# EAGLE design gbikePCB (EAGLE 6.3)
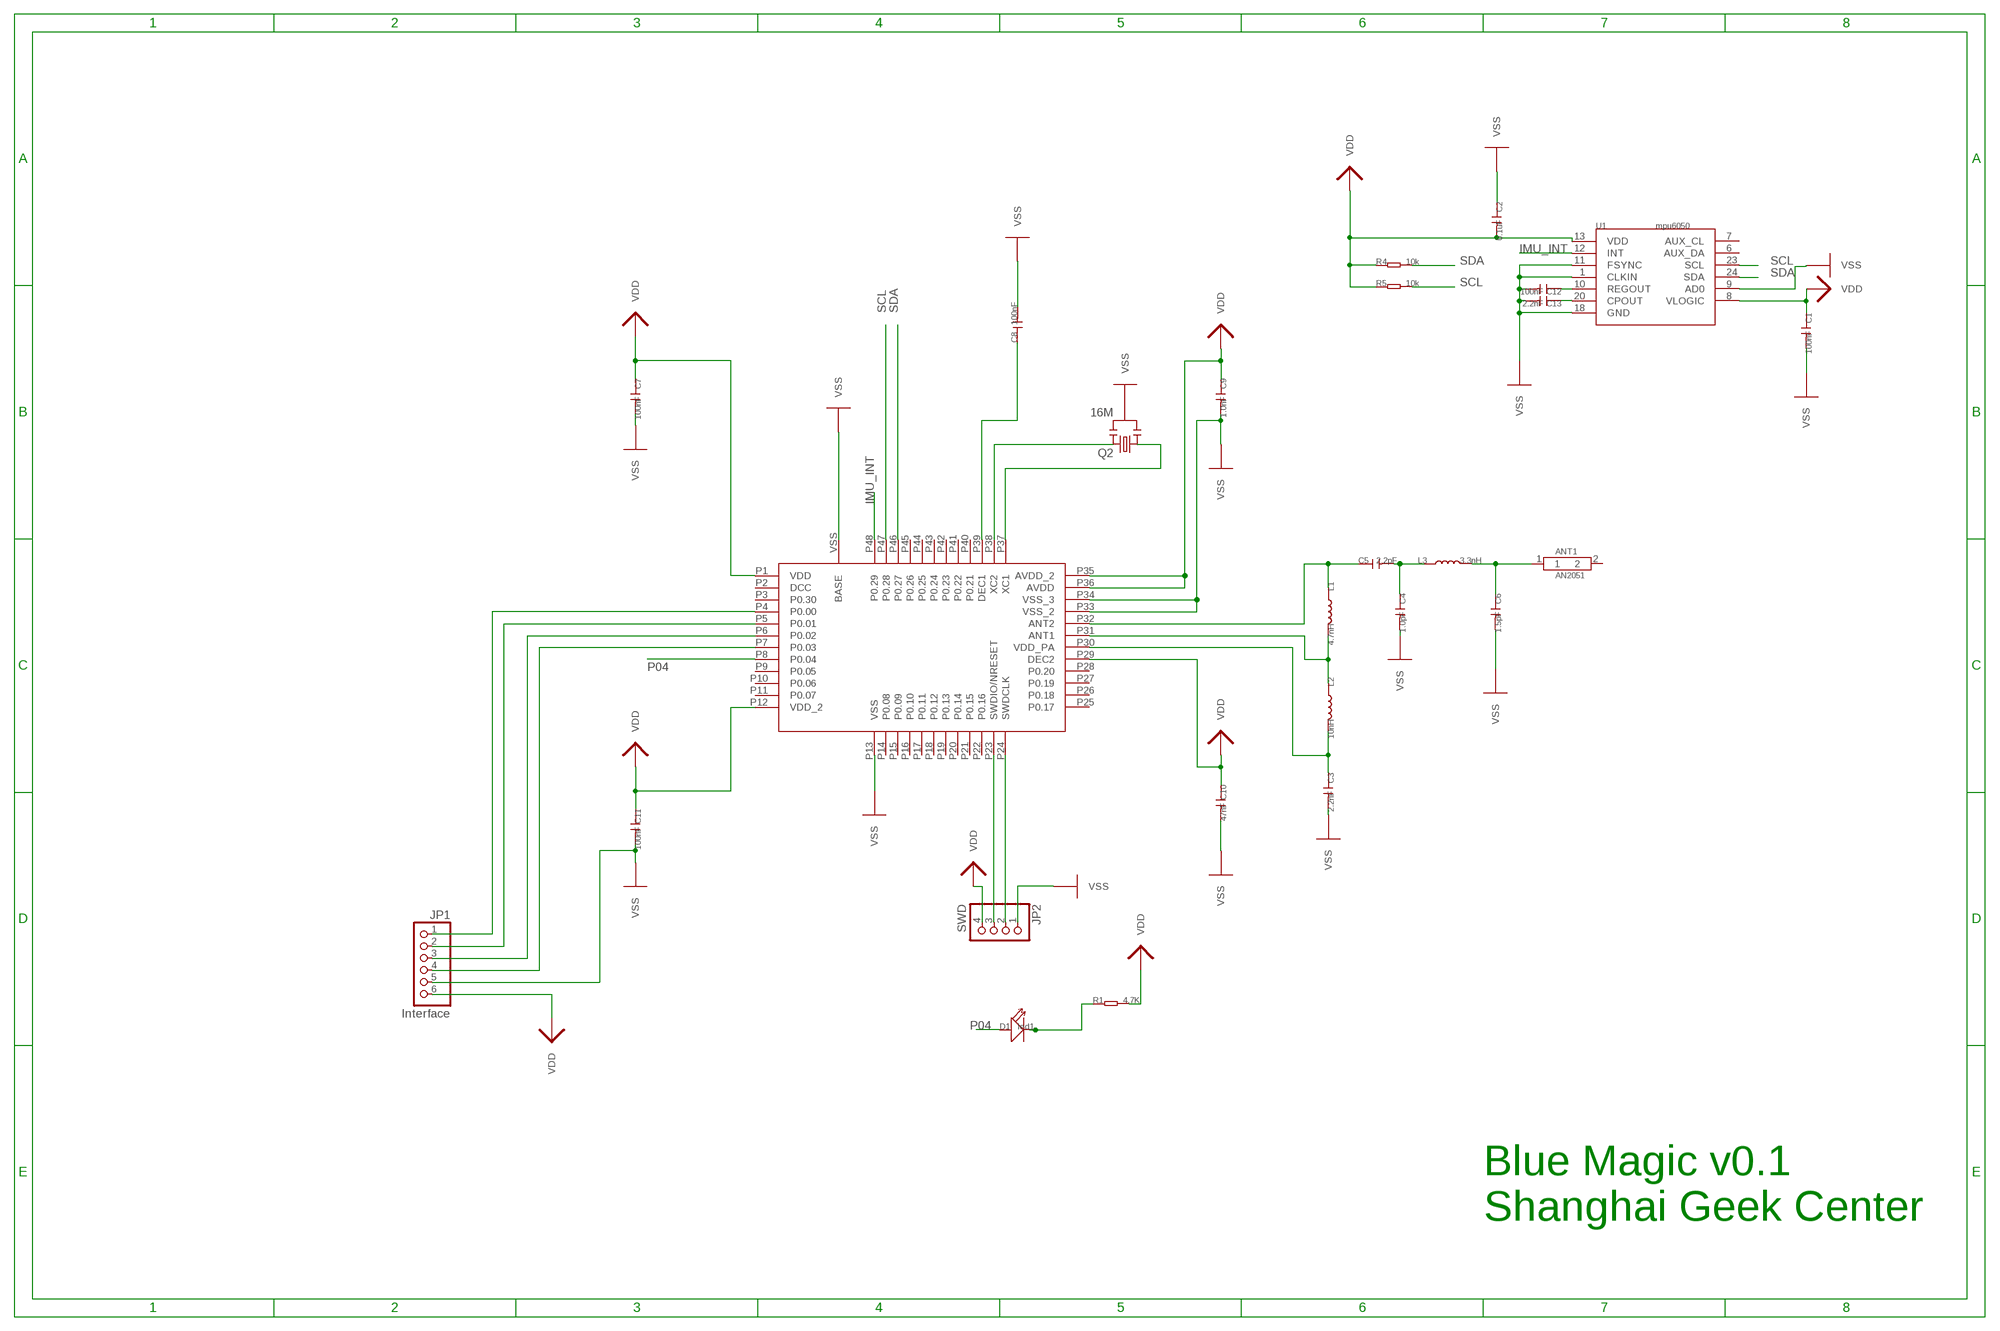
[diagram p0: schematic, sheet 1]

## Parts
ANT1  AN2051  CONNECTOR_ANTENNA-2.4GHZ-0.5DBIAN2051  [CONNECTOR_2P-SMD-L5.05*W.02*H1.07MM]
C1  100nF  DISCRETE_C-0603  [DISCRETE_C0603]
C2  0.1uF  DISCRETE_C-0603  [DISCRETE_C0603]
C3  2.2nF  DISCRETE_C-0603  [DISCRETE_C0603]
C4  1.0pF  DISCRETE_C-0603  [DISCRETE_C0603]
C5  2.2pF  DISCRETE_C-0603  [DISCRETE_C0603]
C6  1.5pF  DISCRETE_C-0603  [DISCRETE_C0603]
C7  100nF  DISCRETE_C-0603  [DISCRETE_C0603]
C8  100nF  DISCRETE_C-0603  [DISCRETE_C0603]
C9  1.0nF  DISCRETE_C-0603  [DISCRETE_C0603]
C10  47nF  DISCRETE_C-0603  [DISCRETE_C0603]
C11  100nF  DISCRETE_C-0603  [DISCRETE_C0603]
C12  100nF  DISCRETE_C-0603  [DISCRETE_C0603]
C13  2.2nF  DISCRETE_C-0603  [DISCRETE_C0603]
D1  led1  DISCRETE_LED0603  [DISCRETE_LED-0603]
JP1  Interface  PINHD-1X6  [1X06]
JP2  SWD  PINHD-1X4  [1X04]
L1  4.7nH  DISCRETE_L0603  [DISCRETE_L0603]
L2  10nH  DISCRETE_L0603  [DISCRETE_L0603]
L3  3.3nH  DISCRETE_L0603  [DISCRETE_L0603]
NRF51822  nRF51822  NRF51822_NRF51822_NRF51822  [NRF51822_NRF51822_QFN48]
Q2  16M  DIYDRONES3_RESONATORSMD  [DIYDRONES3_RESONATOR-SMD]
R1  4.7K  DISCRETE_R-0603  [DISCRETE_R0603]
R4  10k  DISCRETE_R-0603  [DISCRETE_R0603]
R5  10k  DISCRETE_R-0603  [DISCRETE_R0603]
U1  mpu6050  TINY_BLE_V1.0_TEMPLATE_MPU-6050???¡¥  [TINY_BLE_V1.0_TEMPLATE_QFN24]

## Nets
IMU_INT: NRF51822.P48(P0.29) U1.12(INT)
N$2: JP1.1 NRF51822.P4(P0.00)
N$3: C3.1 L2.2 NRF51822.P30(VDD_PA)
N$4: NRF51822.P38(XC2) Q2.3
N$5: C8.1 NRF51822.P39(DEC1)
N$6: C5.1 L1.1 NRF51822.P32(ANT2)
N$7: C4.1 C5.2 L3.1
N$8: ANT1.1 C6.1 L3.2
N$9: NRF51822.P37(XC1) Q2.1
N$10: JP1.2 NRF51822.P5(P0.01)
N$11: JP1.3 NRF51822.P6(P0.02)
N$12: L1.2 L2.1 NRF51822.P31(ANT1)
N$13: JP1.4 NRF51822.P7(P0.03)
N$17: D1.- R1.1
N$18: C12.1 U1.10(REGOUT)
N$19: C13.1 U1.20(CPOUT)
N$28: JP2.3 NRF51822.P23(SWDIO/NRESET)
N$29: JP2.2 NRF51822.P24(SWDCLK)
P04: D1.+ NRF51822.P8(P0.04)
SCL: NRF51822.P47(P0.28) R5.2 U1.23(SCL)
SDA: NRF51822.P46(P0.27) R4.2 U1.24(SDA)
VDD: C1.1 C2.2 C7.1 C9.1 C10.1 C11.1 JP1.6 JP2.4 NRF51822.P1(VDD) NRF51822.P12(VDD_2) NRF51822.P29(DEC2) NRF51822.P35(AVDD_2) NRF51822.P36(AVDD) R1.2 R4.1 R5.1 U1.8(VLOGIC) U1.13(VDD)
VSS: C1.2 C2.1 C3.2 C4.2 C6.2 C7.2 C8.2 C9.2 C10.2 C11.2 C12.2 C13.2 JP1.5 JP2.1 NRF51822.P13(VSS) NRF51822.P33(VSS_2) NRF51822.P34(VSS_3) NRF51822.VSS(BASE) Q2.2 U1.1(CLKIN) U1.9(AD0) U1.11(FSYNC) U1.18(GND)
Unconnected: ANT1.2 NRF51822.P2(DCC) NRF51822.P3(P0.30) NRF51822.P9(P0.05) NRF51822.P10(P0.06) NRF51822.P11(P0.07) NRF51822.P14(P0.08) NRF51822.P15(P0.09) NRF51822.P16(P0.10) NRF51822.P17(P0.11) NRF51822.P18(P0.12) NRF51822.P19(P0.13) NRF51822.P20(P0.14) NRF51822.P21(P0.15) NRF51822.P22(P0.16) NRF51822.P25(P0.17) NRF51822.P26(P0.18) NRF51822.P27(P0.19) NRF51822.P28(P0.20) NRF51822.P40(P0.21) NRF51822.P41(P0.22) NRF51822.P42(P0.23) NRF51822.P43(P0.24) NRF51822.P44(P0.25) NRF51822.P45(P0.26) U1.6(AUX_DA) U1.7(AUX_CL)

## Notes on the sheet
- Blue Magic v0.1
  Shanghai Geek Center

## Library data of the parts
ANT1 = Tiny_BLE_V1.0:CONNECTOR_ANTENNA-2.4GHZ-0.5DBI: AN2051 Multilayer Chip Antenna for 2.4GHz Wireless Communication
C1-C13 = Tiny_BLE_V1.0:DISCRETE_C*: Ceramic Capacitors
D1 = Tiny_BLE_V1.0:DISCRETE_LED*
JP1 = pinhead:PINHD-1X6: PIN HEADER
JP2 = pinhead:PINHD-1X4: PIN HEADER
L1-L3 = Tiny_BLE_V1.0:DISCRETE_L*
NRF51822 = nRF51822ModifiedFortValue:NRF51822_NRF51822_NRF51822: NRF51822 Nordic Semiconductor 48 pin QFN Metric measurements....
Q2 = APM_v2:DIYDRONES3_RESONATOR: Resonator Small SMD resonator. This is the itty bitty 10/20MHz resonators with built in caps. CSTCE10M0G55 and CSTCE20M0V53. Footprint has been reviewed closely but hasn't been tested yet.
R1 R4 R5 = Tiny_BLE_V1.0:DISCRETE_R*
U1 = nRF51822:TINY_BLE_V1.0_TEMPLATE_MPU-6050

## Net classes
0 default: width 0.102 mm, drill 0.203 mm, clearance 0.102 mm

## Board
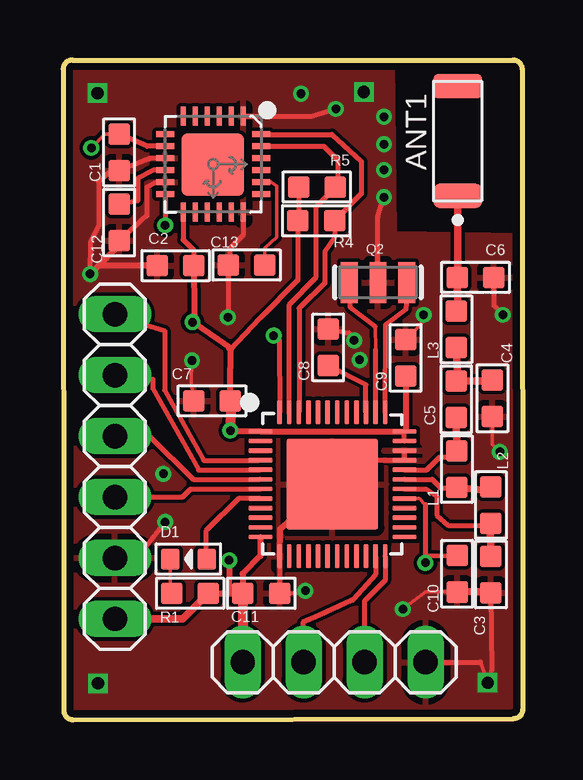
[diagram p1: board, top side]
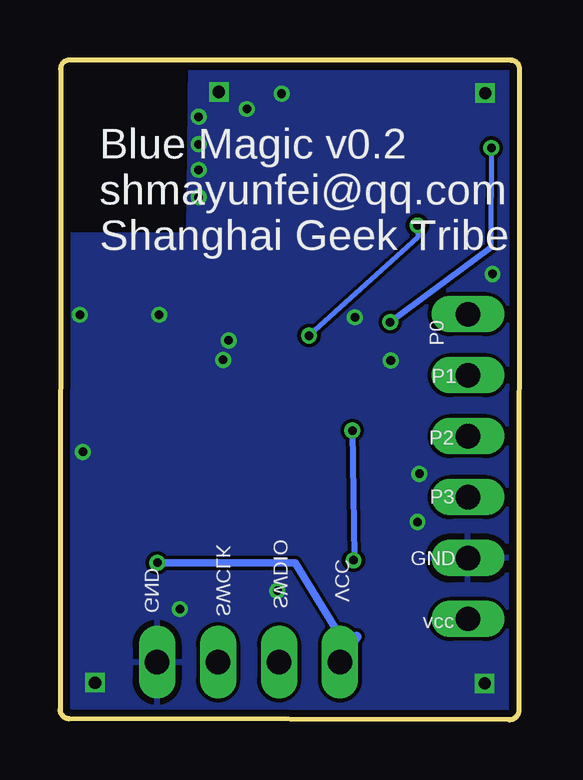
[diagram p2: board, bottom side, seen from below]

Size 19.14 x 27.51 mm. Coordinates in mm from the lower left corner, seen from the top.
Outline: 0.38,27.51 18.74,27.51 arc-91 19.12,27.13 19.14,0.43 arc-90 18.76,0.05 0.41,0 arc-90 0.03,0.38 0,27.13 arc-91 0.38,27.51
Copper layers (1*16): Top 0.0356mm / dielectric 1.5011mm / Bottom 0.0356mm
Design rules "LaenPCBOrder *": minimum track width 6mil, minimum drill 13mil, track to track 6mil, track to pad 6mil, pad to pad 6mil, via to via 6mil, smd to smd 6mil, copper to edge 12mil, drill to drill 6mil, minimum pad ring 6mil, minimum via ring 6mil, stop-mask expansion 4mil, vias tented up to drill 15mil, thermal gap 10mil

### Footprints (pad centres in the part's own frame; a part is rotated, then mirrored left to right if it is on the bottom)
CONNECTOR_2P-SMD-L5.05*W.02*H1.07MM = smd 1.016 x 2.032: 1 -2.286,0; 2 2.286,0
DISCRETE_C0603 = smd 0.889 x 0.889: 1 -0.762,0; 2 0.762,0
DISCRETE_LED-0603 = smd 0.762 x 0.889: + -0.762,0; - 0.762,0
1X06 = drill 1.016 long: 1 -6.35,0; 2 -3.81,0; 3 -1.27,0; 4 1.27,0; 5 3.81,0; 6 6.35,0
1X04 = drill 1.016 long: 1 -3.81,0; 2 -1.27,0; 3 1.27,0; 4 3.81,0
DISCRETE_L0603 = smd 0.889 x 0.889: 1 -0.762,0; 2 0.762,0
NRF51822_NRF51822_QFN48 = smd 1 x 0.2: P1 -3,2.2; P2 -3,1.8; P3 -3,1.4; P4 -3,1; P5 -3,0.6; P6 -3,0.2; P7 -3,-0.2; P8 -3,-0.6; P9 -3,-1; P10 -3,-1.4; P11 -3,-1.8; P12 -3,-2.2; P25 3,-2.2; P26 3,-1.8; P27 3,-1.4; P28 3,-1; P29 3,-0.6; P30 3,-0.2; P31 3,0.2; P32 3,0.6; P33 3,1; P34 3,1.4; P35 3,1.8; P36 3,2.2 | smd 0.2 x 1: P13 -2.2,-3; P14 -1.8,-3; P15 -1.4,-3; P16 -1,-3; P17 -0.6,-3; P18 -0.2,-3; P19 0.2,-3; P20 0.6,-3; P21 1,-3; P22 1.4,-3; P23 1.8,-3; P24 2.2,-3; P37 2.2,3; P38 1.8,3; P39 1.4,3; P40 1,3; P41 0.6,3; P42 0.2,3; P43 -0.2,3; P44 -0.6,3; P45 -1,3; P46 -1.4,3; P47 -1.8,3; P48 -2.2,3 | smd 3.81 x 3.81: VSS 0,0
DIYDRONES3_RESONATOR-SMD = smd 0.7 x 1.7: 1 -1.2,0; 2 0,0; 3 1.2,0
DISCRETE_R0603 = smd 0.889 x 0.889: 1 -0.762,0; 2 0.762,0
TINY_BLE_V1.0_TEMPLATE_QFN24 = smd 0.8 x 0.26: 1 -2,1.25; 2 -2,0.75; 3 -2,0.25; 4 -2,-0.25; 5 -2,-0.75; 6 -2,-1.25; 13 2,-1.25; 14 2,-0.75; 15 2,-0.25; 16 2,0.25; 17 2,0.75; 18 2,1.25 | smd 0.26 x 0.8: 7 -1.25,-2; 8 -0.75,-2; 9 -0.25,-2; 10 0.25,-2; 11 0.75,-2; 12 1.25,-2; 19 1.25,2; 20 0.75,2; 21 0.25,2; 22 -0.25,2; 23 -0.75,2; 24 -1.25,2 | smd 2.6 x 2.6: E 0.02,-0.01

### Placement (x,y rotation side)
ANT1  16.43,24.13 90 top
C1  2.33,23.66 270 top
C2  4.68,18.94 0 top
C3  17.82,6.05 270 top
C4  17.88,13.41 270 top
C5  16.38,13.36 90 top
C6  17.18,18.44 0 top
C7  6.2,13.3 180 top
C8  11.03,15.52 90 top
C9  14.26,15.09 90 top
C10  16.41,6.09 270 top
C11  8.25,5.28 0 top
C12  2.33,20.73 270 top
C13  7.64,18.96 180 top
D1  5.22,6.7 180 top
JP1  2.15,10.56 270 top
JP2  11.29,2.4 180 top
L1  16.4,10.45 270 top
L2  17.82,8.95 270 top
L3  16.38,16.28 90 top
NRF51822  11.21,9.82 0 top
Q2  13.11,18.24 180 top
R1  5.29,5.28 0 top
R4  10.54,20.81 0 top
R5  10.57,22.21 0 top
U1  6.25,23.16 270 top

### Tracks (layer width: path | path; a pad name or v marks a point on that pad's centre or on a via)
IMU_INT  (via drill 0.36)
  Top 0.152: U1.12
  Top 0.203: U1.12 v4.25,20.62 | v8.77,16.02 9,15.84 NRF51822.P48
  Bottom 0.203: v4.25,20.62 4.25,20.11 v8.77,16.02
N$2
  Top 0.154: JP1.1 2.09,16.88 | 8.15,10.81 NRF51822.P4
  Top 0.203: 2.09,16.88 4.22,16.22 4.22,13.74 5.85,10.81 8.15,10.81
N$3
  Top 0.154: 17.8,8.11 L2.2 17.8,8.01
  Top 0.203: NRF51822.P30 15.12,9.62 15.57,9.3 15.57,8.53 16.03,8.11 17.8,8.11
  Top 0.305: C3.1 17.8,8.01
N$4
  Top 0.154: 13.01,15.43 12.99,16.39
  Top 0.203: NRF51822.P38 13.01,15.43 | Q2.3 11.97,17.2 12.99,16.39
N$5
  Top 0.203: NRF51822.P39 12.61,13.98 C8.1
N$6
  Top 0.154: 16.27,10.96 L1.1 | C5.1
  Top 0.203: NRF51822.P32 15.15,10.42 15.68,10.96 16.27,10.96
  Top 0.305: L1.1 C5.1
N$7
  Top 0.154: 17.84,14.12 C4.1 | 16.43,14.18 C5.2
  Top 0.305: C5.2 17.84,14.12 | L3.1 16.43,14.18
N$8
  Top 0.154: 16.43,18.62 C6.1 | 16.44,17.08 L3.2
  Top 0.305: ANT1.1 16.43,18.62 | C6.1 16.44,17.08
N$9
  Top 0.154: 14.33,17.57 14.31,18.36 Q2.1
  Top 0.203: NRF51822.P37 13.44,16.48 14.28,17.12 14.33,17.57
N$10
  Top 0.154: JP1.2 2.11,14.37 | 8.18,10.41 NRF51822.P5
  Top 0.203: 2.11,14.37 3.74,14.19 3.74,13.81 5.64,10.41 8.18,10.41
N$11
  Top 0.154: JP1.3 3.59,11.83 | 8.19,10.03 NRF51822.P6
  Top 0.203: 3.59,11.83 5.41,10.03 8.19,10.03
N$12
  Top 0.154: 16.26,9.66 L1.2 | 17.85,9.54 L2.1
  Top 0.203: NRF51822.P31 15.37,10.02 15.73,9.66 16.26,9.66
  Top 0.305: L1.2 17.85,9.54
N$13
  Top 0.154: NRF51822.P7
  Top 0.203: JP1.4 4.98,9.29 5.31,9.62 NRF51822.P7
N$17
  Top 0.154: D1.- 4.46,5.35 R1.1
N$18
  Top 0.203: U1.10 3.75,22.91 3.1,22.57 3.1,21.63 C12.1
N$19
  Top 0.152: U1.20 8.67,22.41 8.89,22.24 8.89,20.12 8.4,19.67 C13.1
N$28
  Top 0.203: NRF51822.P23 13.01,6.07 12.07,5 10.67,4.36 9.99,4.06 9.99,2.87 JP2.3
N$29
  Top 0.203: NRF51822.P24 13.41,5.81 12.55,4.95 12.55,2.79 JP2.2
P04
  Top 0.154: 5.95,6.73 D1.+
  Top 0.203: NRF51822.P8 7.3,9.22 5.95,7.87 5.95,6.73
SCL
  Top 0.152: 11.43,22.32 R5.2 11.33,22.19 | 9.4,12.79 NRF51822.P47
  Top 0.203: U1.23 10.86,23.91 11.43,23.34 11.43,22.32 | 11.33,22.19 10.52,21.38 10.52,18.43 9.4,17.29 9.4,12.79
SDA
  Top 0.152: U1.24 8.25,24.46 8.21,24.4 | 9.83,12.84 NRF51822.P46
  Top 0.203: 8.21,24.4 11.21,24.4 12.42,23.29 12.42,21.93 R4.2 11.3,20.13 10.9,19.53 10.9,18.21 9.83,17.16 9.83,12.84
VDD  (via drill 0.36, 0.36 pad 0.25)
  Top 0.152: 9.81,20.84 R4.1 | 7.01,15.49 6.91,15.49 | C1.1 1.72,24.42 v1.17,23.84 | v5.39,16.58 5.5,16.48 5.37,16.4 5.47,16.53 | C2.2
  Top 0.154: 14.26,12.07 NRF51822.P36 | NRF51822.P1 | 7.47,5.3 C11.1 | 7.49,2.79 JP2.4 | 6.85,12.02 v6.96,12.06 | v15.09,6.55 15.17,6.83 | NRF51822.P29 14.83,9.22 15.09,8.96
  Top 0.203: NRF51822.P35 NRF51822.P36 | 15.17,6.83 C10.1 | 15.09,8.96 v15.09,6.55 | R5.1 9.81,20.84 | R4.1 9.78,18.33 8.21,16.76 6.96,15.41 | U1.8 3.5,23.91 C1.1 | U1.13 5,20.02 5.44,19.58 C2.2
  Top 0.254: NRF51822.P36 NRF51822.P1 6.85,12.02 | C9.1 14.26,12.07 | NRF51822.P12 8.21,6.83 7.47,6.09 7.47,5.3 | R1.2 6.66,5.28 | 6.66,5.28 C11.1 | 6.91,15.49 6.96,15.41 6.96,14.67 6.96,13.63 C7.1 | C2.2 5.47,17.09 5.47,16.53 7.01,15.49 | v6.91,6.65 6.89,5.25 6.66,5.28
  Top 0.305: JP1.6 4.98,4.21 R1.2
  Top 0.406: C11.1 7.49,2.79 | C7.1 6.99,13.04 v6.96,12.06
  Bottom 0.154: JP2.4 7.48,3.53
  Bottom 0.203: v1.17,23.84 1.2,19.68
  Bottom 0.254: 1.2,19.68 v5.39,16.58 | v6.96,12.06 6.89,6.78 v6.91,6.65
  Bottom 0.305: 7.48,3.53 9.35,6.55 v15.09,6.55
  Bottom 0.406: 6.79,3.47 JP2.4
VSS  (via drill 0.36, 0.36 pad 0.25, 0.51 pad 0.25)
  Top 0.152: C1.2 2.03,22.92 | U1.11 3.88,22.41 | 6.94,19.02 C13.2 | 6.88,16.98 v6.86,16.78
  Top 0.154: C11.2 9.99,5.28 v10.09,5.38 | C7.2 5.34,14.06 v5.36,14.98 | 17.4,2.4 v17.68,1.54 17.85,2.06 | 13.95,15.54 C9.2 14.91,16.5 v15.02,16.88 | C4.2 17.88,11.48 v18.19,11.17 | C10.2 15.11,5.32 v14.15,4.62
  Top 0.203: NRF51822.VSS 11.88,10.81 NRF51822.P33 NRF51822.P34 | NRF51822.P13 C11.2 | JP2.1 17.4,2.4 | C3.2 17.85,2.06 | JP1.5 3.07,6.75 v4.25,8.25 | C6.2 17.94,17.26 v18.32,16.88 | C8.2 11.9,16.13 v12.12,15.82 | Q2.2 13.11,20.98 v13.36,21.79 | 2.03,22.92 1.48,22.42 1.48,20.57 1.15,19.96 v1.12,18.59 | U1.9 3.59,23.39 C1.2 | 3.88,22.41 3.48,22.22 3.48,21.02 C12.2 | U1.1 10.34,25.16 v11.36,25.47 | U1.18 7.5,20.21 6.94,19.65 6.94,19.02 | C13.2 6.88,16.98
  Top 0.254: NRF51822.P13 9.03,7.96 NRF51822.VSS | C12.2 2.33,19.8 v1.12,18.59 1.47,18.94 C2.1
  Top 0.305: C10.2 17.21,5.35 C3.2
  other vias: 4.17,10.26 9.91,26.1 13.36,25.14 13.36,24 13.36,22.93 1.45,1.52 12.35,15.01 1.43,26.13 12.53,26.18
  pour Top: 13.74,27.41 0.61,27.41 arc89 0.23,27.03 0.13,0.12 18.84,0.18 arc90 19.22,0.56 19.12,20.18 13.81,20.28
  pour Bottom: 0.08,0.1 18.8,0.28 arc89 19.17,0.66 19.27,20.26 13.79,20.23 13.69,27.44 0.58,27.34 arc89 0.2,26.96

### Text on the board
bPlace: Blue Magic v0.2 / shmayunfei@qq.com / Shanghai Geek Tribe | P0 | P1 | P2 | P3 | GND | VCC | SWDIO | GND | vcc | SWCLK